# Altium schematic sheet Fri3D_2020_GameOn_02.SchDoc: GameOn
size A3; Date: 06/06/2022; DrawnBy: Wim Van Gool; DocumentNumber: 1; Revision: 02; SheetNumber: 1; SheetTotal: 1
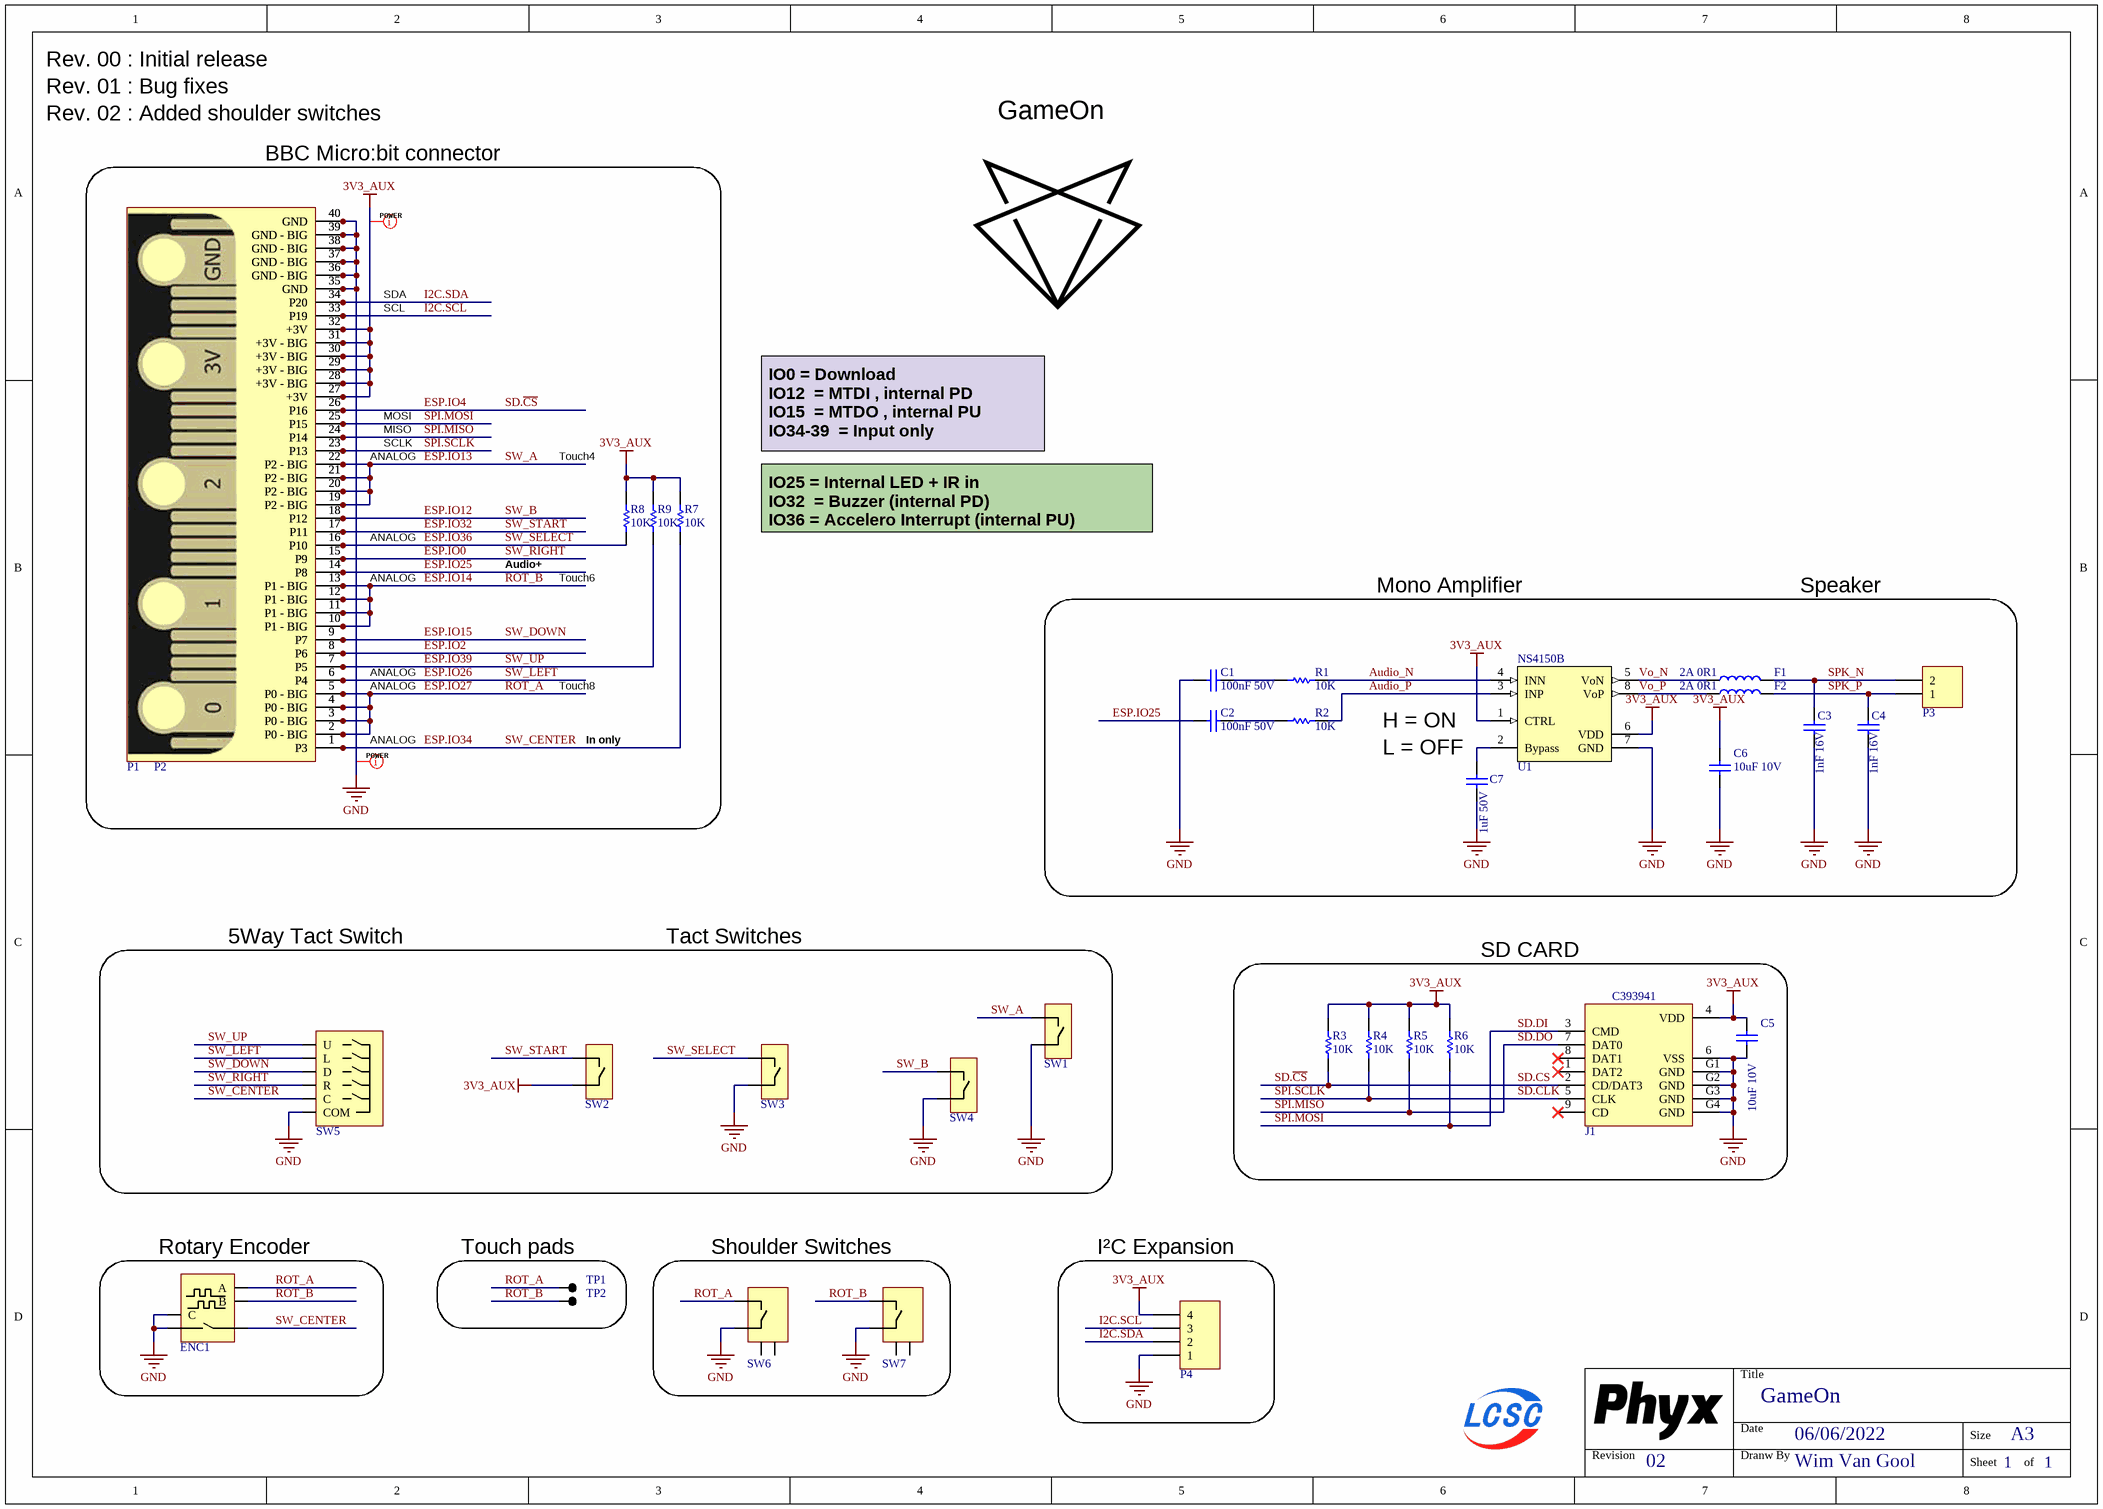
[diagram p0: Fri3D_2020_GameOn_02.SchDoc]

## Parts
C1  value 100nF 50V  [C0603_N]  (hidden comment: CAP_CERAMIC)
C2  value 100nF 50V  [C0603_N]  (hidden comment: CAP_CERAMIC)
C3  value 1nF 16V  [C0603_N]  (hidden comment: CAP_CERAMIC)
C4  value 1nF 16V  [C0603_N]  (hidden comment: CAP_CERAMIC)
C5  value 10uF 10V  [C0805_N]  (hidden comment: CAP_CERAMIC)
C6  value 10uF 10V  [C0805_N]  (hidden comment: CAP_CERAMIC)
C7  value 1uF 50V  [C0603_N]  (hidden comment: CAP_CERAMIC)
ENC1  Rotary Encoder with Switch  [PEC11-4215F-S0024]  (value not drawn)
F1  value 2A 0R1  [L0805]  (hidden comment: FERRITE)
F2  value 2A 0R1  [L0805]  (hidden comment: FERRITE)
J1  Supplier Part Number 1: C393941  [TFP09-2-12B]  (hidden comment: Micro SD PiPo Push-Push)
P1  MicroBit 90deg connector Cylconn  [MicroBIT_CYLCONN_SMD_90]  (value not drawn)
P2  MicroBit 180deg connector Cylconn  [MicroBIT_CYLCONN_SMD_180]  (value not drawn)
P3  Header 2  [HDR1X2]  (value not drawn)
P4  Header 4  [HDR1X4]  (value not drawn)
R1  value 10K  [R0603_N]  (hidden comment: RESISTOR)
R2  value 10K  [R0603_N]  (hidden comment: RESISTOR)
R3  value 10K  [R0603_N]  (hidden comment: RESISTOR)
R4  value 10K  [R0603_N]  (hidden comment: RESISTOR)
R5  value 10K  [R0603_N]  (hidden comment: RESISTOR)
R6  value 10K  [R0603_N]  (hidden comment: RESISTOR)
R7  value 10K  [R0603_N]  (hidden comment: RESISTOR)
R8  value 10K  [R0603_N]  (hidden comment: RESISTOR)
R9  value 10K  [R0603_N]  (hidden comment: RESISTOR)
SW1  Default TH TACT  [TACTSW]  (value not drawn)
SW2  Default TH TACT  [TACTSW]  (value not drawn)
SW3  Default TH TACT  [TACTSW]  (value not drawn)
SW4  Default TH TACT  [TACTSW]  (value not drawn)
SW5  5Way Tact switch  [TACTSW_5W_K1-1506DN-01]  (value not drawn)
SW6  Tact switch, RA, 3,85mm  [TACTSW_RA_385]  (value not drawn)
SW7  Tact switch, RA, 3,85mm  [TACTSW_RA_385]  (value not drawn)
TP1  TEST_PAD  [TP_1.2mm]  (value not drawn)
TP2  TEST_PAD  [TP_1.2mm]  (value not drawn)
U1  value NS4150B  [MAX_uSOP8]  (hidden comment: 5W Class D mono amplifier inducter-less Differential input MSOP8)

## Blocks framed on the sheet
BBC Micro:bit connector: P1 P2 R7-R9
SD CARD: C5 J1 R3-R6
Rotary Encoder: ENC1
Touch pads: TP1 TP2
Shoulder Switches: SW6 SW7
I²C Expansion: P4

## Nets
3V3_AUX: C5.1 C6.1 J1.4(VDD) P1.27(+3V) P1.28(+3V_-_BIG) P1.29(+3V_-_BIG) P1.30(+3V_-_BIG) P1.31(+3V_-_BIG) P1.32(+3V) P2.27(+3V) P2.28(+3V_-_BIG) P2.29(+3V_-_BIG) P2.30(+3V_-_BIG) P2.31(+3V_-_BIG) P2.32(+3V) P4.4 R3.1 R4.1 R5.1 R6.1 R7.1 R8.1 R9.1 SW2.2 U1.1(CTRL) U1.6(VDD)
GND: C1.2 C3.2 C4.2 C5.2 C6.2 C7.2 ENC1.1 ENC1.C J1.6(VSS) J1.G1(GND) J1.G2(GND) J1.G3(GND) J1.G4(GND) P1.35(GND) P1.36(GND_-_BIG) P1.37(GND_-_BIG) P1.38(GND_-_BIG) P1.39(GND_-_BIG) P1.40(GND) P2.35(GND) P2.36(GND_-_BIG) P2.37(GND_-_BIG) P2.38(GND_-_BIG) P2.39(GND_-_BIG) P2.40(GND) P4.1 SW1.2 SW3.2 SW4.2 SW5.4(COM) SW6.2 SW7.2 U1.7(GND)
Audio_N: R1.2 U1.4(INN)
Audio_P: R2.2 U1.3(INP)
ESP.IO0: P1.15(P9) P2.15(P9) SW5.5(R)  [also labelled SW_RIGHT]
ESP.IO2: P1.8(P6) P2.8(P6)
ESP.IO4: J1.2(CD/DAT3) P1.26(P16) P2.26(P16) R3.2  [also labelled SD.~{CS}, SD.CS]
ESP.IO12: P1.18(P12) P2.18(P12) SW4.1  [also labelled SW_B]
ESP.IO13: P1.19(P2_-_BIG) P1.20(P2_-_BIG) P1.21(P2_-_BIG) P1.22(P2_-_BIG) P2.19(P2_-_BIG) P2.20(P2_-_BIG) P2.21(P2_-_BIG) P2.22(P2_-_BIG) SW1.1  [also labelled SW_A]
ESP.IO14: ENC1.B P1.10(P1_-_BIG) P1.11(P1_-_BIG) P1.12(P1_-_BIG) P1.13(P1_-_BIG) P2.10(P1_-_BIG) P2.11(P1_-_BIG) P2.12(P1_-_BIG) P2.13(P1_-_BIG) SW7.1 TP2.1  [also labelled ROT_B]
ESP.IO15: P1.9(P7) P2.9(P7) SW5.3(D)  [also labelled SW_DOWN]
ESP.IO25: C2.2 P1.14(P8) P2.14(P8)
ESP.IO26: P1.6(P4) P2.6(P4) SW5.2(L)  [also labelled SW_LEFT]
ESP.IO27: ENC1.A P1.2(P0_-_BIG) P1.3(P0_-_BIG) P1.4(P0_-_BIG) P1.5(P0_-_BIG) P2.2(P0_-_BIG) P2.3(P0_-_BIG) P2.4(P0_-_BIG) P2.5(P0_-_BIG) SW6.1 TP1.1  [also labelled ROT_A]
ESP.IO32: P1.17(P11) P2.17(P11) SW2.1  [also labelled SW_START]
ESP.IO34: ENC1.2 P1.1(P3) P2.1(P3) R7.2 SW5.6(C)  [also labelled SW_CENTER]
ESP.IO36: P1.16(P10) P2.16(P10) R8.2 SW3.1  [also labelled SW_SELECT]
ESP.IO39: P1.7(P5) P2.7(P5) R9.2 SW5.1(U)  [also labelled SW_UP]
I2C.SCL: P1.33(P19) P2.33(P19) P4.3
I2C.SDA: P1.34(P20) P2.34(P20) P4.2
SD.CLK: J1.5(CLK) P1.23(P13) P2.23(P13) R4.2  [also labelled SPI.SCLK]
SD.DI: J1.3(CMD) P1.25(P15) P2.25(P15) R6.2  [also labelled SPI.MOSI]
SD.DO: J1.7(DAT0) P1.24(P14) P2.24(P14) R5.2  [also labelled SPI.MISO]
SPK_N: C3.1 F1.2 P3.2
SPK_P: C4.1 F2.2 P3.1
Vo_N: F1.1 U1.5(VoN)
Vo_P: F2.1 U1.8(VoP)
NetC1_1: C1.1 R1.1
NetC2_1: C2.1 R2.1
NetC7_1: C7.1 U1.2(Bypass)

Not connected (* = marked no-connect by the designer): J1 1(DAT2)* 8(DAT1)* 9(CD)*; SW6 MH1 MH2; SW7 MH1 MH2

## Layout directives
net class POWER: 3V3_AUX, GND

## Notes on the sheet
- Rev. 00 : Initial release
- Rev. 01 : Bug fixes
- Rev. 02 : Added shoulder switches
- SDA
- SCL
- MOSI
- MISO
- SCLK
- IO0	= Download
  IO12 	= MTDI , internal PD
  IO15 	= MTDO , internal PU
  IO34-39 	= Input only
- ANALOG
- Touch4
- Audio+
- Touch6
- IO25	= Internal LED + IR in
  IO32 	= Buzzer (internal PD)
  IO36	= Accelero Interrupt (internal PU)
- Mono Amplifier
- Speaker
- Touch8
- In only
- H = ON
- (near C7) L = OFF
- 5Way Tact Switch
- Tact Switches
- Title
- Revision
- Date
- Dranw By
- Size
- A3
- Sheet
- of

## Library data of the parts
C1 C2 = CAP # 100nF 50V 0603: Capacitor Ceramic; Supplier 1: Farnell; Supplier Part Number 1: 1759122
C3 C4 = CAP # 1nF 16V 0603: Capacitor Ceramic
C5 C6 = CAP # 10uF 10V 0805: Capacitor Ceramic; Supplier 1: Farnell; Supplier Part Number 1: 2320859
C7 = CAP # 1uF 50V 0603: Capacitor Ceramic; Supplier 1: Farnell; Supplier Part Number 1: 2112858
ENC1 = ENC ROT INC 24-24ppr SW: Value: PEC11-4215F-S0024; Supplier 1: Farnell; Supplier Part Number 1: 1653380
F1 F2 = FER # 600R 2A 0805 0R10: Supplier 1: Farnell; Supplier Part Number 1: 1838838
J1 = MicroSD TFP09-2-12B Push-Push: =Description; Value: TFP09-2-12B; Supplier 1: LCSC
P1 = MicroBit # RA Cylconn: Supplier 1: TaoBao
P2 = MicroBit # Cylconn: Supplier 1: TaoBao
P3 = Pin Header 2.54mm 2way
P4 = Pin Header 2.54mm 4way
R1-R9 = RES # 10K 0603: Supplier 1: Farnell; Supplier Part Number 1: 2502397
SW1-SW4 = SW TACT
SW5 = SW TACT 5W K1-1506DN-01: Value: K1-1506DN-01; Supplier 1: LCSC; Supplier Part Number 1: C145911
SW6 SW7 = SW TACT RA 3,85mm 431256038716: Value: 431256038716; Supplier 1: Wurth; Supplier Part Number 1: 431256038716; Supplier 2: Mouser; Supplier Part Number 2: 710-431256038716
TP1 TP2 = TP # 1.2mm: Value: NO BOM
U1 = AMP # AUDIO NS4150B: =Description; Supplier 1: LCSC; Supplier Part Number 1: C189961